# EAGLE design untitled (EAGLE 8.2.0)

## Sheet 1 of 6: Güç Bölümü 220V/5V
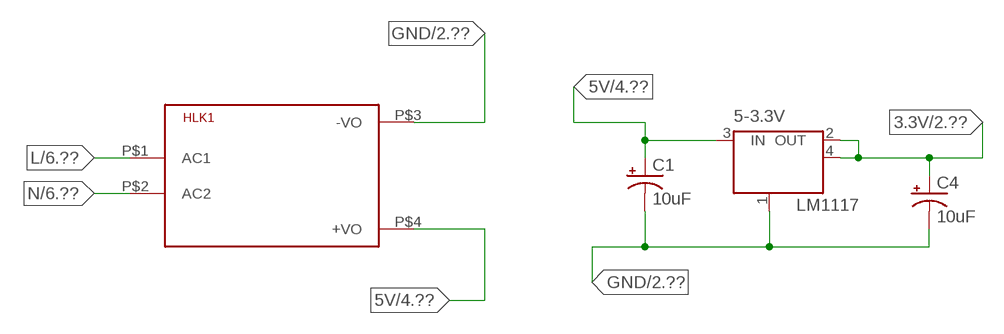
[diagram p0: schematic, sheet 1]

### Parts
5-3.3V  LM1117  [SOT223]
C1  10uF  10UF-TANT  [EIA3216]
C4  10uF  10UF-TANT  [EIA3216]
HLK1  HLK-PM013W  [HLK-PM01]

### Nets
3.3V: 5-3.3V.2(OUT) 5-3.3V.4(OUT) C4.A(+) ; also sheet 2,3,5
5V: 5-3.3V.3(IN) C1.A(+) HLK1.P$4(+VO) ; also sheet 4
GND: 5-3.3V.1(GND/ADJ) C1.C(-) C4.C(-) HLK1.P$3(-VO) ; also sheet 2,3,4,5,6
L [L-N]: HLK1.P$1(AC1) ; also sheet 6
N [L-N]: HLK1.P$2(AC2) ; also sheet 6

## Sheet 2 of 6: ESP8266
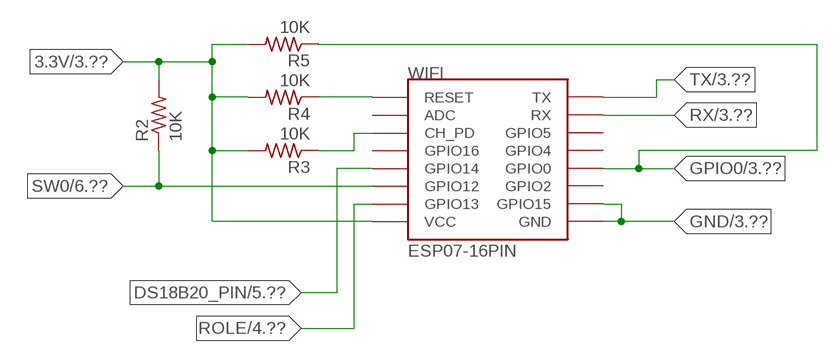
[diagram p1: schematic, sheet 2]

### Parts
R2  10K  R-US_R0805  [R0805]
R3  10K  R-US_R0805  [R0805]
R4  10K  R-US_R0805  [R0805]
R5  10K  R-US_R0805  [R0805]
WIFI  ESP07-16PIN  [ESP07-16PIN]

### Nets
3.3V: R2.2 R3.2 R4.2 R5.2 WIFI.VCC ; also sheet 1,3,5
DS18B20_PIN: WIFI.GPIO14 ; also sheet 5
GND: WIFI.GND WIFI.GPIO15 ; also sheet 1,3,4,5,6
GPIO0: R5.1 WIFI.GPIO0 ; also sheet 3
N$5: R4.1 WIFI.REST(RESET)
N$6: R3.1 WIFI.CH_PD
ROLE: WIFI.GPIO13 ; also sheet 4
RX: WIFI.RX ; also sheet 3
SW0: R2.1 WIFI.GPIO12 ; also sheet 6
TX: WIFI.TX ; also sheet 3
Unconnected: WIFI.ADC WIFI.GPIO2 WIFI.GPIO4 WIFI.GPIO5 WIFI.GPIO16

## Sheet 3 of 6: Programlama Pinleri
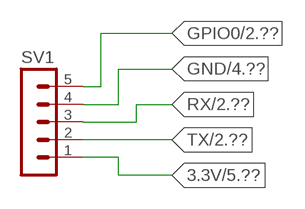
[diagram p2: schematic, sheet 3]

### Parts
SV1  MA05-1  [MA05-1]

### Nets
3.3V: SV1.1 ; also sheet 1,2,5
GND: SV1.4 ; also sheet 1,2,4,5,6
GPIO0: SV1.5 ; also sheet 2
RX: SV1.3 ; also sheet 2
TX: SV1.2 ; also sheet 2

## Sheet 4 of 6: Röle
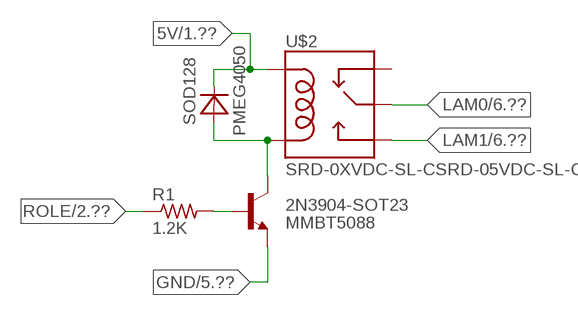
[diagram p3: schematic, sheet 4]

### Parts
2N3904-SOT23  MMBT5088  TRANSISTOR_NPNMMBT5088  [SOT23-3]
R1  1.2K  R-US_R0805  [R0805]
SOD128  PMEG4050  [SOD128]
U$2  SRD-0XVDC-SL-CSRD-05VDC-SL-C  [SRD-0XVDC-SL-C]

### Nets
5V: SOD128.1(C) U$2.COIL1 ; also sheet 1
GND: 2N3904-SOT23.2(E) ; also sheet 1,2,3,5,6
LAM0 [L-N]: U$2.SWCOMMON ; also sheet 6
LAM1 [L-N]: U$2.SWOPEN ; also sheet 6
N$1: 2N3904-SOT23.1(B) R1.2
N$2: 2N3904-SOT23.3(C) SOD128.2(A) U$2.COIL0
ROLE: R1.1 ; also sheet 2
Unconnected: U$2.SWCLOSED(SWCLOSE)

## Sheet 5 of 6: Sıcaklık Sensörü
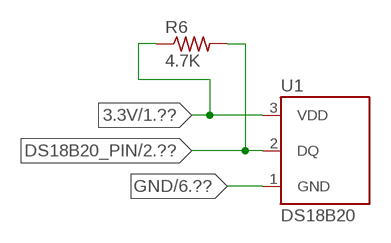
[diagram p4: schematic, sheet 5]

### Parts
R6  4.7K  R-US_R0805  [R0805]
U1  DS18B20  [TO-92-AMMO]

### Nets
3.3V: R6.1 U1.3(VDD) ; also sheet 1,2,3
DS18B20_PIN: R6.2 U1.2(DQ) ; also sheet 2
GND: U1.1(GND) ; also sheet 1,2,3,4,6

## Sheet 6 of 6: Klemensler
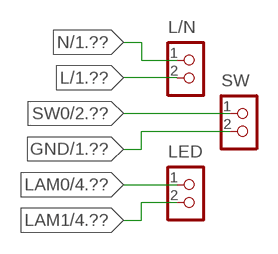
[diagram p5: schematic, sheet 6]

### Parts
L/N  CON_TERMINAL_BLOCK_02-5MM  [TERMINAL_BLOCK_2P_5]
LED  CON_TERMINAL_BLOCK_02-5MM  [TERMINAL_BLOCK_2P_5]
SW  CON_TERMINAL_BLOCK_02-5MM  [TERMINAL_BLOCK_2P_5]

### Nets
GND: SW.2 ; also sheet 1,2,3,4,5
L [L-N]: L/N.2 ; also sheet 1
LAM0 [L-N]: LED.1 ; also sheet 4
LAM1 [L-N]: LED.2 ; also sheet 4
N [L-N]: L/N.1 ; also sheet 1
SW0: SW.1 ; also sheet 2

## Library data of the parts
2N3904-SOT23 = SparkFun-DiscreteSemi:TRANSISTOR_NPN: Generic NPN BJT MMBT2222A - TRANS-08049 (SOT-23, 1A 40V) MPSA42 - TRANS-09116 (SOT-23, 500mA 300V) MMBT5088LT1G - TRANS-11160 (SOT-23, 50 mA 30V) BC547 - COM-08928 <http://www.sparkfun.com/products/8928> (TO-92 45V 100mA) (1.Collector 2.Base 3.Emitter) 2N3904 - COM-00521 <http://www.sparkfun.com/products/521> (TO-92 40V 200mA) (1.Emitter 2.Base 3.Collector) P2N2222A - COM-12852 <http://www.sparkfun.com/products/12852> (TO-92 40V 600mA) (1.Collector 2.Base 3.Emitter); PROD_ID: TRANS-11160
5-3.3V = voltage_regulators:LM1117
C1 C4 = SparkFun-Retired:10UF-TANT: 10uF Tantalum SMT CAP-00811- 16V 10% (EIA-3216); PROD_ID: CAP-00811
HLK1 = HLK-PM01:HLK-PM01: Hi-Link Power Supply HLK-PM01 3W Author: Ahmed Said <https://github.com/AhmedSaid/EAGLELibraries>
L/N LED SW = dp_devices:CON_TERMINAL_BLOCK_02: 2 poles wire to board terminal block
R1-R6 = adafruit:R-US_: RESISTOR, American symbol
SOD128 = AWJLEagleLib:PMEG4050: NXP PMEG4050 Schottky diode
SV1 = con-lstb:MA05-1: PIN HEADER; OC_FARNELL: unknown; OC_NEWARK: unknown
U1 = SparkFun-Sensors:DS18B20: Dallas/Maxim DS18B20 1-wire temperature sensor Datasheet: http://datasheets.maximintegrated.com/en/ds/DS18B20.pdf temp thermometer 1-wire one-wire one wire; STORE_ID: SEN-00245
U$2 = SRD-0XVDC-SL-C:SRD-0XVDC-SL-C: SRD-05VDC-SL-C SRD-06VDC-SL-C Compatible with: SONGLE Relays SHUN YU JQX-3F other same relays Author: Ahmed Said <https://github.com/AhmedSaid/EAGLELibraries>
WIFI = esp8266modules:ESP07-16PIN: ESP8266 Wifi module 07 - 16 pins; DIMENSIONS: 22.0 x 16.0 mm; PINS: 16; PITCH: 0.078" / 2 mm

## Net classes
0 default: width 0.305 mm, drill 0.508 mm, clearance 0.254 mm
1 L-N: width 1.016 mm, drill 0.508 mm, clearance 0.508 mm

## Board
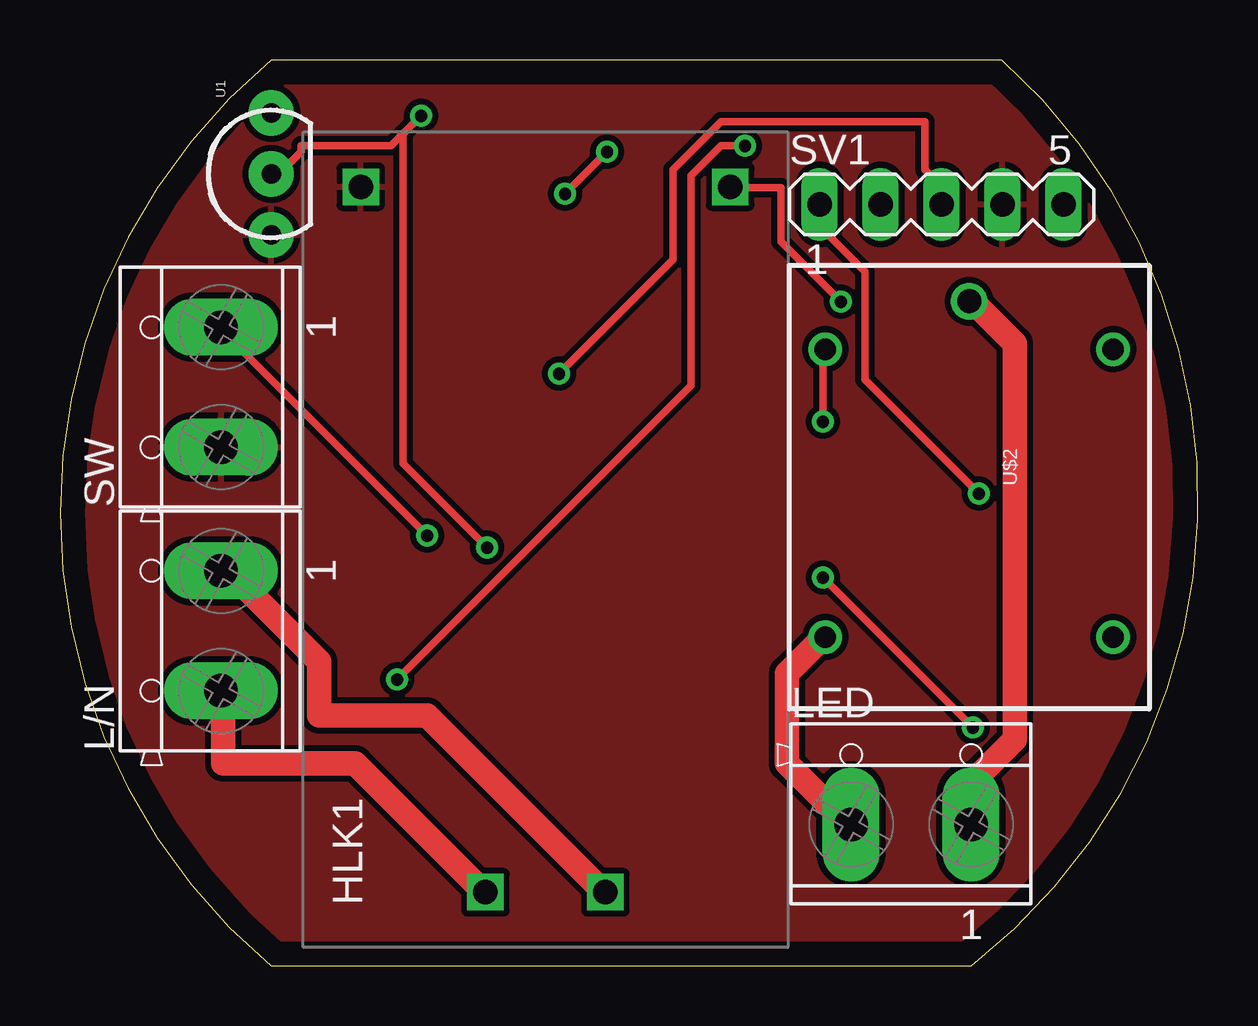
[diagram p6: board, top side]
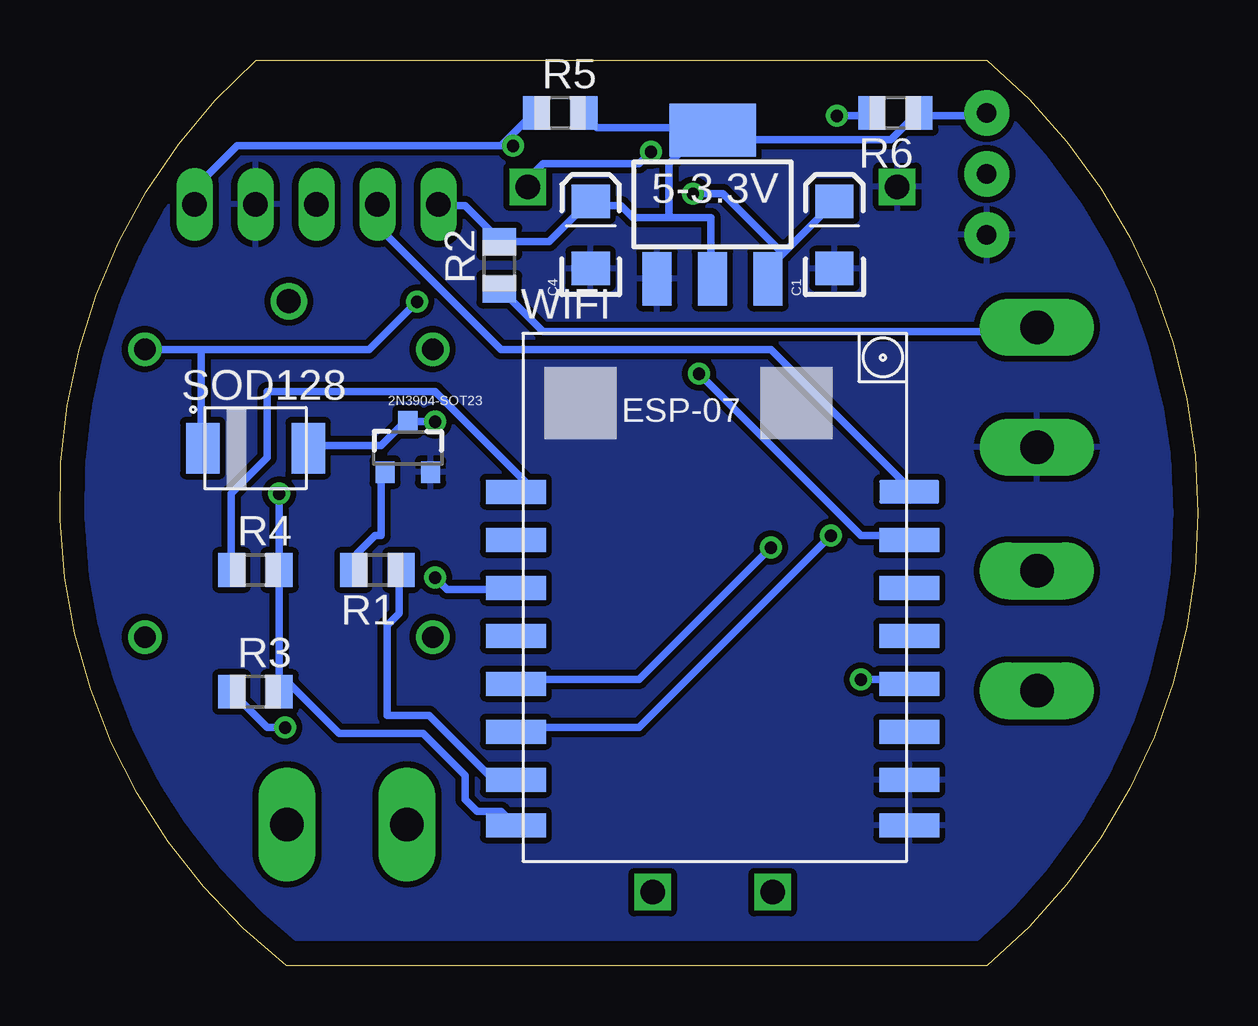
[diagram p7: board, bottom side, seen from below]

Size 47.44 x 37.77 mm. Coordinates in mm from the lower left corner, seen from the top.
Outline: 8.81,0 38,0 arc100 39.27,37.77 8.81,37.77 arc100 8.81,0
Copper layers (1*16): Top 0.035mm / dielectric 1.5mm / Bottom 0.035mm
Design rules "default": minimum track width 6mil, minimum drill 0.35mm, track to track 6mil, track to pad 6mil, pad to pad 6mil, via to via 6mil, smd to smd 6mil, copper to edge 40mil, drill to drill 6mil, minimum pad ring 10mil, minimum via ring 8mil, stop-mask expansion 4mil, vias tented up to drill 0mil, thermal gap 10mil

### Footprints (pad centres in the part's own frame; a part is rotated, then mirrored left to right if it is on the bottom)
SOT23-3 = smd 0.8 x 0.9: 1 -0.95,-1; 2 0.95,-1; 3 0,1.1
SOT223 = smd 1.219 x 2.235: 1 -2.311,-3.099; 2 0,-3.099; 3 2.311,-3.099 | smd 3.6 x 2.2: 4 0,3.099
EIA3216 = smd 1.4 x 1.6: A 1.4,0; C -1.4,0
HLK-PM01 = drill 1.016 square: P$1 -14.7,2.5; P$2 -14.7,-2.5; P$3 14.7,7.7; P$4 14.7,-7.7
TERMINAL_BLOCK_2P_5 = drill 1.4 pad 2.38 long: 1 2.5,-0.45; 2 -2.5,-0.45
R0805 = smd 1.1 x 1.4: 1 -1,0; 2 1,0
SOD128 = smd 1.4 x 2.1: 1 -2.2,0; 2 2.2,0
MA05-1 = drill 1.016 long: 1 -5.08,0; 2 -2.54,0; 3 0,0; 4 2.54,0; 5 5.08,0
TO-92-AMMO = drill 0.813 pad 1.88: 1 -2.54,0; 2 0,0; 3 2.54,0
SRD-0XVDC-SL-C = drill 0.9: COIL0 -5.39,-6.12; COIL1 -5.39,5.88; SWCLOSED 6.61,5.88; SWOPEN 6.61,-6.12 | drill 1: SWCOMMON -7.39,-0.12
ESP07-16PIN = smd 2.5 x 1: ADC -8.2,3.8; CH_PD -8.2,1.8; GND 8.2,-8.105; GPIO0 8.2,-2.2; GPIO2 8.2,-4.2; GPIO4 8.2,-0.2; GPIO5 8.2,1.8; GPIO12 -8.2,-4.2; GPIO13 -8.2,-6.2; GPIO14 -8.2,-2.2; GPIO15 8.2,-6.2; GPIO16 -8.2,-0.2; REST -8.2,5.8; RX 8.2,3.8; TX 8.2,5.8; VCC -8.2,-8.105

### Placement (x,y rotation side)
2N3904-SOT23  32.94,21.59 0 bottom
5-3.3V  20.24,31.75 0 bottom
C1  15.16,30.48 90 bottom
C4  25.32,30.48 90 bottom
HLK1  20.24,17.78 90 top
L/N  6.27,13.97 90 top
LED  35.48,6.35 0 top
R1  34.21,16.51 180 bottom
R2  29.13,29.21 90 bottom
R3  39.29,11.43 0 bottom
R4  39.29,16.51 0 bottom
R5  26.59,35.56 0 bottom
R6  12.62,35.56 180 bottom
SOD128  39.29,21.59 0 bottom
SV1  36.75,31.75 0 top
SW  6.27,24.13 90 top
U1  8.81,33.02 90 top
U$2  38.02,20.32 270 top
WIFI  20.24,13.97 0 bottom

### Tracks (layer width: path | path; a pad name or v marks a point on that pad's centre or on a via)
3.3V  (via drill 0.51)
  Top 0.305: v38.3,19.69 33.55,24.44 33.55,28.94 31.8,30.69 31.8,31.69 SV1.1
  Bottom 0.305: 38.3,11.69 38.3,16.44 R4.2 38.3,16.69 v38.3,19.69 | 38.3,11.69 R3.2 38.3,11.69 | 38.3,11.69 37.8,11.69 35.8,9.69 32.3,9.69 30.55,7.94 30.55,6.94 30.05,6.44 29.05,6.44 28.55,5.94 WIFI.VCC | SV1.1 31.55,31.69 30.55,31.69 29.3,30.44 R2.2 29.05,30.19 27.05,30.19 25.55,31.69 C4.A 25.3,31.69 24.05,31.69 23.55,31.19 22.05,31.19 | 22.05,31.19 20.3,31.19 20.3,28.69 5-3.3V.2 | U1.3 9.05,35.44 11.55,35.44 R6.1 11.8,35.44 12.8,34.44 19.8,34.44 20.05,34.69 5-3.3V.4 | 20.55,34.94 20.3,34.94 5-3.3V.4 | 20.55,34.94 25.05,34.94 25.55,35.44 R5.2 | 22.05,31.19 22.05,33.44 20.55,34.94 | 20.55,34.94 5-3.3V.4
5V  (via drill 0.51)
  Top 0.305: v32.55,27.69 30.05,30.19 30.05,32.44 28.05,32.44 HLK1.P$4 | v22.8,33.94 v21.05,32.19
  Bottom 0.305: 17.3,29.69 17.8,29.19 17.8,28.69 5-3.3V.3 | 17.3,29.69 15.3,31.69 C1.A | 41.55,25.69 41.55,21.69 SOD128.1 | 41.55,25.69 43.8,25.69 U$2.COIL1 | v32.55,27.69 34.55,25.69 41.55,25.69 | 17.3,29.69 19.8,32.19 v21.05,32.19 | v22.8,33.94 23.3,33.44 27.3,33.44 28.05,32.69 HLK1.P$4
DS18B20_PIN  (via drill 0.51)
  Top 0.305: 14.3,34.69 13.8,34.19 10.05,34.19 10.05,33.94 9.05,32.94 U1.2 | 14.3,34.69 v15.05,35.44 | v17.8,17.44 14.3,20.94 14.3,34.69
  Bottom 0.305: v15.05,35.44 13.8,35.44 R6.2 | v17.8,17.44 23.3,11.94 28.3,11.94 WIFI.GPIO14
GND
  pour Top: -6.43,46.99 -6.43,-10.16 49.45,-10.16 49.45,48.26 -6.43,48.26
  pour Bottom: -11.51,45.72 53.26,45.72 53.26,-7.62 -11.51,-7.62
GPIO0  (via drill 0.51)
  Top 0.305: v14.05,11.94 26.3,24.19 26.3,32.94 27.55,34.19 v28.55,34.19
  Bottom 0.305: 28.8,34.44 29.05,34.19 40.05,34.19 41.8,32.44 41.8,31.94 SV1.5 | 28.8,34.44 27.8,35.44 R5.1 | v14.05,11.94 12.05,11.94 WIFI.GPIO0 | 28.8,34.44 v28.55,34.19
L
  Top 1.016: HLK1.P$1 17.55,3.19 12.3,8.44 6.8,8.44 6.8,11.44 L/N.2
LAM0
  Top 1.016: U$2.SWCOMMON 38.05,27.69 39.8,25.94 39.8,9.44 38.05,7.69 38.05,5.94 LED.1
LAM1
  Top 1.016: U$2.SWOPEN 31.8,13.69 30.3,12.19 30.3,8.44 32.8,5.94 LED.2
N
  Top 1.016: HLK1.P$2 22.55,3.19 15.3,10.44 10.8,10.44 10.8,12.69 6.8,16.69 L/N.1
N$1
  Bottom 0.305: 2N3904-SOT23.1 34.05,20.44 34.05,17.94 34.3,17.94 35.05,17.19 35.05,16.69 R1.2
N$2  (via drill 0.51)
  Top 0.305: v31.8,22.69 31.8,25.69 U$2.COIL0
  Bottom 0.305: SOD128.2 37.05,21.69 34.05,21.69 33.05,22.69 2N3904-SOT23.3 v31.8,22.69
N$5
  Bottom 0.305: R4.1 40.3,16.69 40.3,19.69 38.8,21.19 38.8,23.94 31.8,23.94 28.05,20.19 28.05,19.94 28.3,19.94 WIFI.REST
N$6  (via drill 0.51)
  Top 0.305: v31.8,16.19 v38.05,9.94
  Bottom 0.305: R3.1 38.8,9.94 v38.05,9.94 | v31.8,16.19 31.3,15.69 28.55,15.69 WIFI.CH_PD
ROLE
  Bottom 0.305: R1.1 33.3,16.44 33.3,14.69 33.8,14.19 33.8,10.44 32.05,10.44 29.55,7.94 28.55,7.94 WIFI.GPIO13
RX  (via drill 0.51)
  Top 0.305: v20.8,24.69 25.55,29.44 25.55,33.19 27.55,35.19 36.05,35.19 36.05,33.19 36.55,32.69 36.55,31.94 SV1.3
  Bottom 0.305: v20.8,24.69 14.05,17.94 12.05,17.94 WIFI.RX
SW0  (via drill 0.51)
  Top 0.305: v15.3,17.94 6.8,26.44 SW.1
  Bottom 0.305: R2.1 29.05,28.19 27.3,26.44 6.8,26.44 SW.1 | v15.3,17.94 23.3,9.94 28.3,9.94 WIFI.GPIO12
TX
  Bottom 0.305: WIFI.TX 12.05,19.94 17.8,25.69 29.05,25.69 34.05,30.69 34.05,31.69 SV1.2